# EAGLE design carret (EAGLE 5.11)
A: a
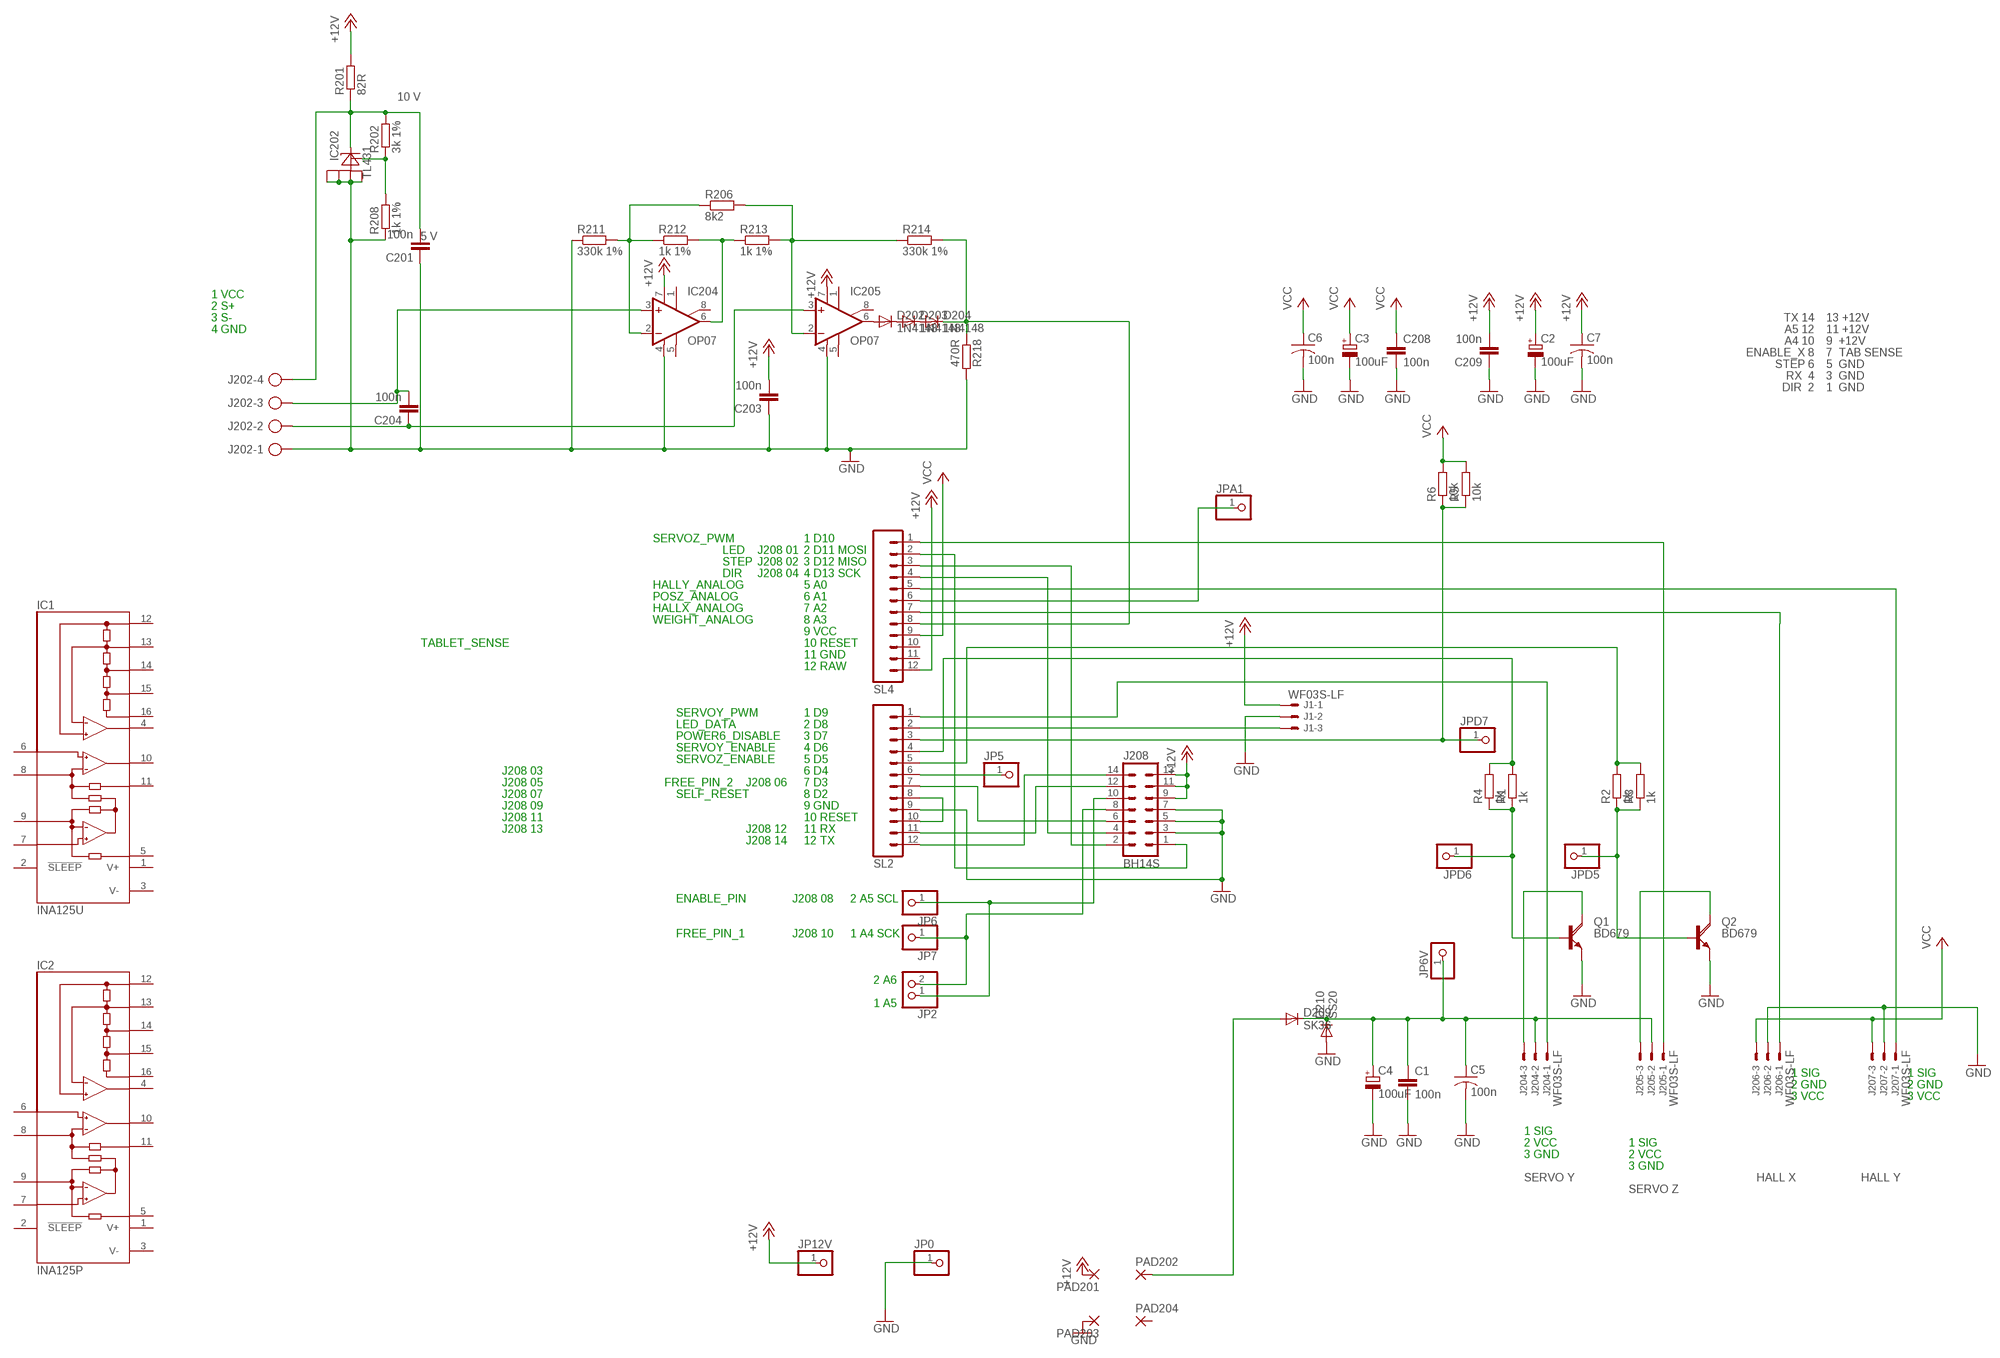
[diagram p0: schematic, sheet 1]

## Parts
C1  100n  CAP  [0805]
C2  100uF  CPOL-EUE3.5-8  [E3,5-8]
C3  100uF  CPOL-EUE3.5-8  [E3,5-8]
C4  100uF  CPOL-EUE3.5-8  [E3,5-8]
C5  100n  C-US050-030X075  [C050-030X075]
C6  100n  C-US050-030X075  [C050-030X075]
C7  100n  C-US050-030X075  [C050-030X075]
C201  100n  CAP  [0805]
C203  100n  CAP  [0805]
C204  100n  CAP  [0805]
C208  100n  CAP  [0805]
C209  100n  CAP  [0805]
D202  1N4148  DIODE-SOD80C  [SOD80C]
D203  1N4148  DIODE-SOD80C  [SOD80C]
D204  1N4148  DIODE-SOD80C  [SOD80C]
D209  SK36  DIODE-SMC  [SMC]
D210  SS20  DIODE-DO214AA  [DO214AA]
IC1  INA125U  [SO16-1]
IC2  INA125P  [DIL16]
IC202  TL431  [SO08]
IC204  OP07  OP07CR  [SO08]
IC205  OP07  OP07CR  [SO08]
J1  WF03S-LF  22-27-2031-03  [6410-03]
J202  AK300/4  [AK300/4]
J204  WF03S-LF  22-27-2031-03  [6410-03]
J205  WF03S-LF  22-27-2031-03  [6410-03]
J206  WF03S-LF  22-27-2031-03  [6410-03]
J207  WF03S-LF  22-27-2031-03  [6410-03]
J208  BH14S  ML14  [ML14]
JP0  PINHD-1X1  [1X01]
JP2  PINHD-1X2  [1X02]
JP5  PINHD-1X1  [1X01]
JP6  PINHD-1X1  [1X01]
JP6V  PINHD-1X1  [1X01]
JP7  PINHD-1X1  [1X01]
JP12V  PINHD-1X1  [1X01]
JPA1  PINHD-1X1  [1X01]
JPD5  PINHD-1X1  [1X01]
JPD6  PINHD-1X1  [1X01]
JPD7  PINHD-1X1  [1X01]
PAD201  3,81/1,1  [3,81/1,1]
PAD202  3,81/1,1  [3,81/1,1]
PAD203  3,81/1,1  [3,81/1,1]
PAD204  3,81/1,1  [3,81/1,1]
Q1  BD679  [TO126AV]
Q2  BD679  [TO126AV]
R1  1k  RES0805  [0805]
R2  1k  RES0805  [0805]
R3  1k  R-EU_0207/10  [0207/10]
R4  1k  R-EU_0207/10  [0207/10]
R5  10k  RES0805  [0805]
R6  10k  R-EU_0207/10  [0207/10]
R201  82R  RES0805  [0805]
R202  3k 1%  RES0805  [0805]
R206  8k2  RES0805  [0805]
R208  1k 1%  RES0805  [0805]
R211  330k 1%  RES0805  [0805]
R212  1k 1%  RES0805  [0805]
R213  1k 1%  RES0805  [0805]
R214  330k 1%  RES0805  [0805]
R218  470R  RES0805  [0805]
SL2  M12  [12P]
SL4  M12  [12P]

## Nets
+10V: C201.2 IC202.1(K) J202.4 R201.1 R202.2
+12V [power12]: C2.+ C7.1 C203.2 C209.2 IC204.7(V+) IC205.7(V+) J1.1 J208.9 J208.11 J208.13 JP12V.1 PAD201.1(P) R201.2 SL4.12
GND [ground]: C1.2 C2.- C3.- C4.- C5.2 C6.2 C7.2 C201.1 C203.1 C208.2 C209.1 D210.A IC202.2(A) IC202.3(A1) IC202.6(A2) IC202.7(A3) IC204.4(V-) IC205.4(V-) J1.2 J202.1 J206.2 J207.2 J208.3 J208.5 J208.7 JP0.1 PAD203.1(P) Q1.E Q2.E R208.1 R211.1 R218.2 SL2.9
N$1: JPD6.1 Q1.B R1.1 R4.1
N$2: J208.14 SL2.12
N$3: J1.3 SL2.2
N$4: JPD7.1 R5.1 R6.1 SL2.3
N$5: J206.1 SL4.7
N$6: J208.1 SL4.2
N$7: J208.12 SL2.11
N$8: J208.2 SL4.3
N$9: J208.10 JP2.1 JP6.1
N$10: J205.1 SL4.1
N$11: J208.8 JP2.2 JP7.1
N$12: J208.4 SL4.4
N$13: IC205.2(-IN) R206.2 R213.2 R214.1
N$14 [power12]: D209.A PAD202.1(P)
N$15: SL2.8 SL2.10
N$16: J207.1 SL4.5
N$17: J204.3 Q1.C
N$18: R1.2 R4.2 SL2.4
N$19: R2.2 R3.2 SL2.5
N$20: J205.3 Q2.C
N$21: J204.1 SL2.1
N$22 [power6]: C1.1 C4.+ C5.1 D209.C D210.C J204.2 J205.2 JP6V.1
N$23: JPD5.1 Q2.B R2.1 R3.1
N$24: JP5.1 SL2.6
N$27: J208.6 SL2.7
N$28: JPA1.1 SL4.6
N$41: D204.C R214.2 R218.1 SL4.8
N$43: IC202.8(REF) R202.1 R208.2
N$49: C204.2 IC204.3(+IN) J202.3
N$50: C204.1 IC205.3(+IN) J202.2
N$51: IC204.2(-IN) R206.1 R211.2 R212.1
N$52: IC204.6(OUT) R212.2 R213.1
N$54: D202.A IC205.6(OUT)
N$55: D202.C D203.A
N$56: D203.C D204.A
VCC [power5]: C3.+ C6.1 C208.1 J206.3 J207.3 R5.2 R6.2 SL4.9
Unconnected: IC1.2(!SLEEP) IC1.4(REFOUT) IC1.5(REF) IC1.6(+IN) IC1.7(-IN) IC1.8(RG) IC1.9(RG) IC1.10(OUT) IC1.11(SENSE) IC1.12(REFCOM) IC1.13(REFBG) IC1.14(REF2.5) IC1.15(REF5) IC1.16(REF10) IC2.2(!SLEEP) IC2.4(REFOUT) IC2.5(REF) IC2.6(+IN) IC2.7(-IN) IC2.8(RG) IC2.9(RG) IC2.10(OUT) IC2.11(SENSE) IC2.12(REFCOM) IC2.13(REFBG) IC2.14(REF2.5) IC2.15(REF5) IC2.16(REF10) IC204.1(ON1) IC204.5(OPT) IC204.8(ON2) IC205.1(ON1) IC205.5(OPT) IC205.8(ON2) PAD204.1(P) SL4.10 SL4.11

## Notes on the sheet
- 10 V
- 5 V
- 1 VCC
- 2 S+
- 3 S- | TX 14 | 13 +12V
- 4 GND | A5 12 | 11 +12V
- A4 10 | 9  +12V
- ENABLE_X 8 | 7  TAB SENSE
- STEP 6 | 5  GND
- RX  4 | 3  GND
- DIR  2 | 1  GND
- SERVOZ_PWM | 1 D10
- LED | J208 01 | 2 D11 MOSI
- STEP | J208 02 | 3 D12 MISO
- DIR | J208 04 | 4 D13 SCK
- HALLY_ANALOG | 5 A0
- POSZ_ANALOG | 6 A1
- HALLX_ANALOG | 7 A2
- WEIGHT_ANALOG | 8 A3
- 9 VCC
- TABLET_SENSE | 10 RESET
- 11 GND
- 12 RAW
- SERVOY_PWM | 1 D9
- LED_DATA | 2 D8
- POWER6_DISABLE | 3 D7
- SERVOY_ENABLE | 4 D6
- SERVOZ_ENABLE | 5 D5
- J208 03 | 6 D4
- J208 05 | FREE_PIN_2 | J208 06 | 7 D3
- J208 07 | SELF_RESET | 8 D2
- J208 09 | 9 GND
- J208 11 | 10 RESET
- J208 13 | J208 12 | 11 RX
- J208 14 | 12 TX
- ENABLE_PIN | J208 08 | 2 A5 SCL
- FREE_PIN_1 | J208 10 | 1 A4 SCK
- 2 A6
- 1 A5
- 1 SIG | 1 SIG
- 2 GND | 2 GND
- 3 VCC | 3 VCC
- 1 SIG
- 2 VCC | 1 SIG
- 3 GND | 2 VCC
- 3 GND
- SERVO Y | HALL X | HALL Y
- SERVO Z

## Power pins joined to a net without a drawn wire
V+: IC1.1(V+) IC2.1(V+)
V-: IC1.3(V-) IC2.3(V-)

## Library data of the parts
C1 C201 C203 C204 C208 C209 = barobot:CAP
C2-C4 = rcl:CPOL-EU: POLARIZED CAPACITOR, European symbol
C5-C7 = resistor:C-US: CAPACITOR, American symbol
D202-D204 D209 D210 = diode:DIODE-: DIODE
IC1 = burr-brown:INA125: Instrumentation Amplifier with Precision Voltage Reference; MF: TEXAS INSTRUMENT CONNECTORS; MPN: INA125U; OC_FARNELL: 1304375; OC_NEWARK: 80K5901
IC2 = burr-brown:INA125: Instrumentation Amplifier with Precision Voltage Reference; MF: TEXAS INSTRUMENT CONNECTORS; MPN: INA125P; OC_FARNELL: 1459461; OC_NEWARK: 35C1726
IC202 = 0alib:TL431
IC204 IC205 = linear:OP07*: OP AMP
J1 J204-J207 = con-molex:22-?-03: CONNECTOR wire to board 2.54 mm (.1 inch) pitch header; OC_FARNELL: unknown; OC_NEWARK: unknown
J202 = con-ptr500:AK300/4: CONNECTOR
J208 = con-ml:ML14: HARTING
JP0 JP5 JP6 JP6V JP7 JP12V JPA1 JPD5-JPD7 = pinhead:PINHD-1X1: PIN HEADER
JP2 = pinhead:PINHD-1X2: PIN HEADER
PAD201-PAD204 = wirepad:3,81/1,1: THROUGH-HOLE PAD
Q1 Q2 = transistor-power:BD679: NPN DARLINGTON TRANSISTOR
R1 R2 R5 R201 R202 R206 R208 R211-R214 R218 = barobot:RES
R3 R4 R6 = rcl:R-EU_: RESISTOR, European symbol
SL2 SL4 = con-amp-quick:M12: AMP QUICK CONNECTOR; OC_FARNELL: unknown; OC_NEWARK: unknown

## Net classes
0 default: width 0.381 mm, drill 0.254 mm, clearance 0.254 mm
1 power12: width 1.27 mm
2 ground: width 0.508 mm
3 power5: width 0.508 mm
4 power6: width 0.813 mm

## Board
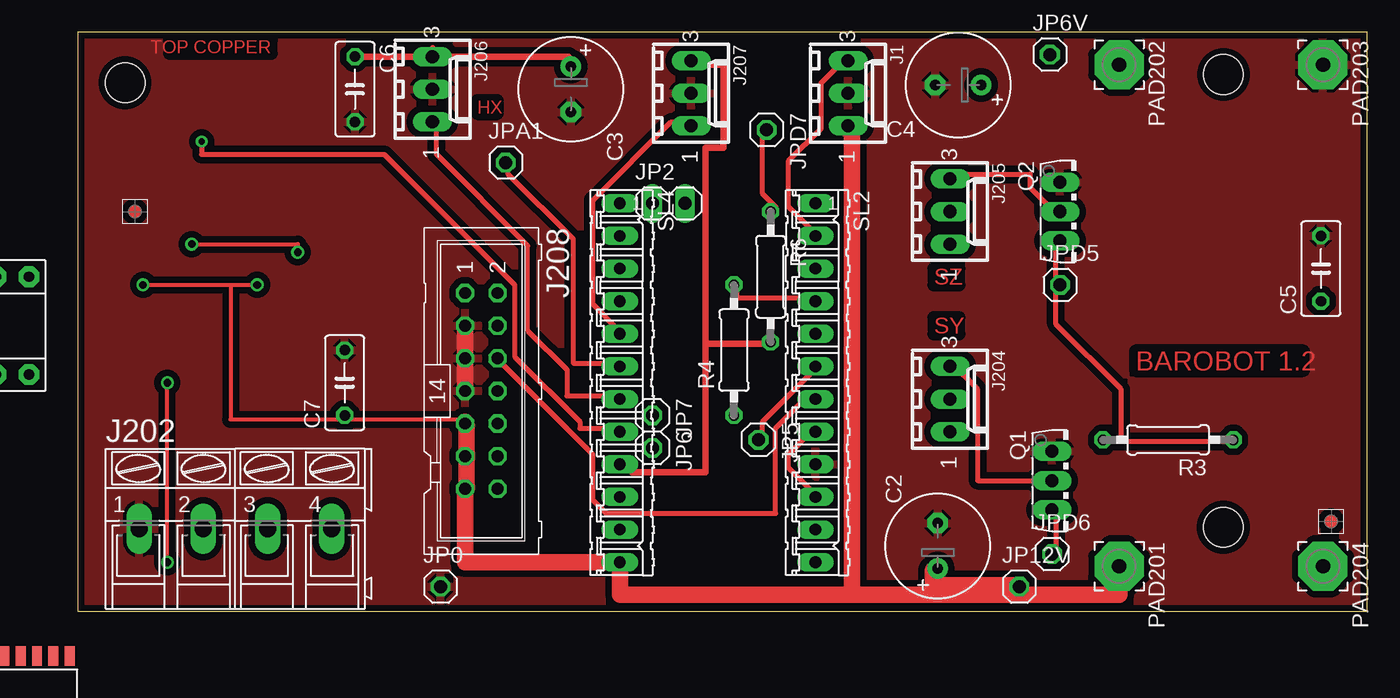
[diagram p1: board, top side]
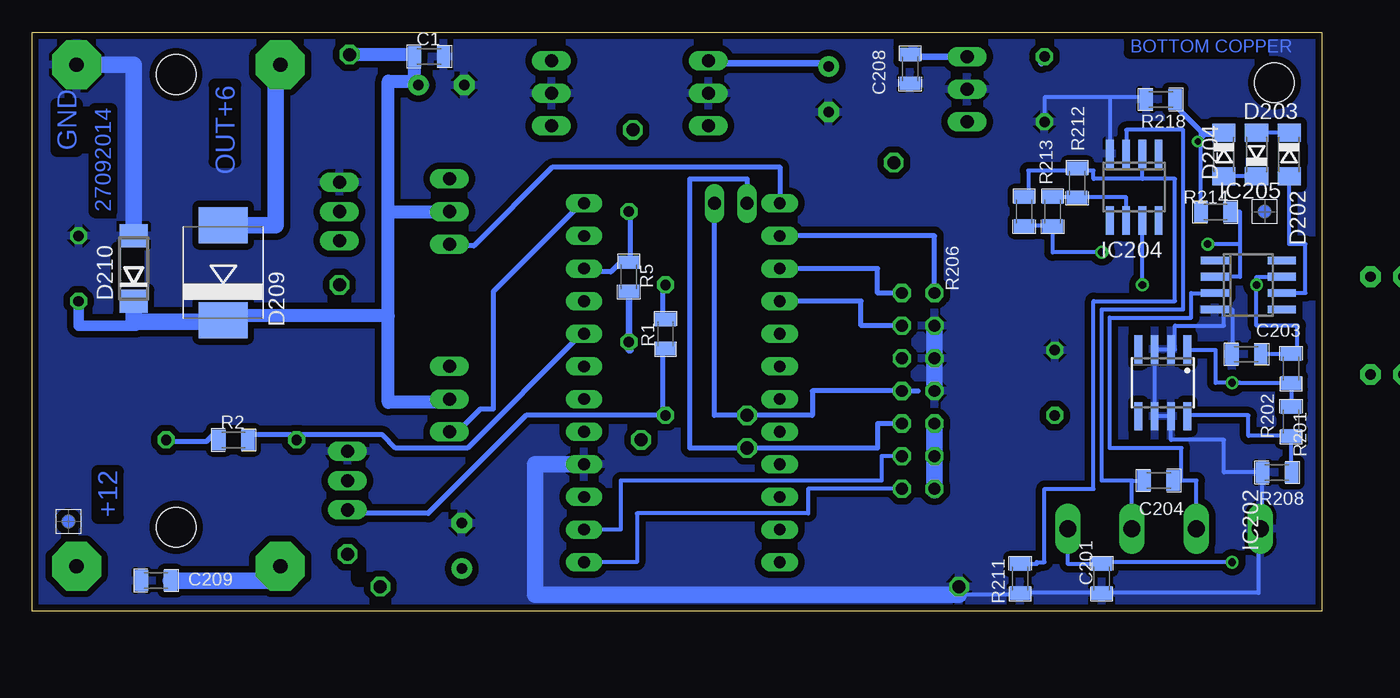
[diagram p2: board, bottom side, seen from below]

Size 100.46 x 45.09 mm. Coordinates in mm from the lower left corner, seen from the top.
Outline: 0,0 100.46,0 100.46,45.09 0,45.09 0,0
Copper layers (1*16): Top 0.035mm / dielectric 1.5mm / Bottom 0.035mm
Design rules "default *": minimum track width 10mil, minimum drill 0.5mm, track to track 10mil, track to pad 10mil, pad to pad 8mil, via to via 10mil, smd to smd 8mil, copper to edge 20mil, drill to drill 8mil, minimum pad ring 10mil, minimum via ring 8mil, stop-mask expansion 0mil, vias tented up to drill 0mil, thermal gap 10mil
Holes 3.1 mm at 89.23,6.54 89.25,41.78 3.68,41.15
bRestrict: area 92.2,25.4 to 93.8,28.3; area 1.6,34.9 to 8.6,36.2; area 74.9,2.4 to 75.1,4.6

### Footprints (pad centres in the part's own frame; a part is rotated, then mirrored left to right if it is on the bottom)
0805 = smd 1.044 x 1.6: 1 -1.127,0; 2 1.127,0
E3,5-8 = drill 0.813 pad 1.6 round: + -1.778,0 | drill 0.813 pad 1.6 octagon: - 1.778,0
C050-030X075 = drill 0.813 octagon: 1 -2.54,0; 2 2.54,0
SOD80C = smd 1.4 x 1.8: A 1.7,0; C -1.7,0
SMC = smd 2.8 x 3.8: A 3.7,0; C -3.7,0
DO214AA = smd 1.8 x 2.2: A 2.55,0; C -2.55,0
SO16-1 = smd 0.762 x 1.524: 1 -4.445,-4.775; 2 -3.175,-4.775; 3 -1.905,-4.775; 4 -0.635,-4.775; 5 0.635,-4.775; 6 1.905,-4.775; 7 3.175,-4.775; 8 4.445,-4.775; 9 4.445,4.775; 10 3.175,4.775; 11 1.905,4.775; 12 0.635,4.775; 13 -0.635,4.775; 14 -1.905,4.775; 15 -3.175,4.775; 16 -4.445,4.775
DIL16 = drill 0.813 pad 1.6 octagon: 1 -8.89,-3.81; 2 -6.35,-3.81; 3 -3.81,-3.81; 4 -1.27,-3.81; 5 1.27,-3.81; 6 3.81,-3.81; 7 6.35,-3.81; 8 8.89,-3.81; 9 8.89,3.81; 10 6.35,3.81; 11 3.81,3.81; 12 1.27,3.81; 13 -1.27,3.81; 14 -3.81,3.81; 15 -6.35,3.81; 16 -8.89,3.81
SO08 = smd 0.6 x 2.2: 1 -1.905,-2.6; 2 -0.635,-2.6; 3 0.635,-2.6; 4 1.905,-2.6; 5 1.905,2.6; 6 0.635,2.6; 7 -0.635,2.6; 8 -1.905,2.6
6410-03 = drill 1.016 long: 1 2.54,0; 2 0,0; 3 -2.54,0
AK300/4 = drill 1.321 long: 1 -7.493,0; 2 -2.515,0; 3 2.515,0; 4 7.493,0
ML14 = drill 0.914 octagon: 1 -7.62,-1.27; 2 -7.62,1.27; 3 -5.08,-1.27; 4 -5.08,1.27; 5 -2.54,-1.27; 6 -2.54,1.27; 7 0,-1.27; 8 0,1.27; 9 2.54,-1.27; 10 2.54,1.27; 11 5.08,-1.27; 12 5.08,1.27; 13 7.62,-1.27; 14 7.62,1.27
1X01 = drill 1.016 octagon: 1 0,0
1X02 = drill 1.016 long: 1 -1.27,0; 2 1.27,0
3,81/1,1 = drill 1.118 pad 3.81 octagon: 1 0,0
TO126AV = drill 1.016 long: B 2.286,-1.27; C 0,-1.27; E -2.286,-1.27
0207/10 = drill 0.813 octagon: 1 -5.08,0; 2 5.08,0
12P = drill 0.914 long: 1 -13.97,0; 2 -11.43,0; 3 -8.89,0; 4 -6.35,0; 5 -3.81,0; 6 -1.27,0; 7 1.27,0; 8 3.81,0; 9 6.35,0; 10 8.89,0; 11 11.43,0; 12 13.97,0

### Placement (x,y rotation side)
C1  69.53,43.18 0 bottom
C2  66.99,5.08 90 top
C3  38.42,40.64 270 top
C4  68.58,40.96 180 top
C5  96.84,26.67 90 top
C6  21.59,40.64 270 top
C7  20.8,17.78 90 top
C201  17.14,2.54 90 bottom
C203  5.87,20 0 bottom
C204  12.7,10.16 180 bottom
C208  32.07,42.23 270 bottom
C209  90.8,2.38 0 bottom
D202  2.54,35.56 270 bottom
D203  5.08,35.56 90 bottom
D204  7.62,35.56 270 bottom
D209  85.57,26.35 90 bottom
D210  92.55,26.67 90 bottom
IC1  -5.08,-8.26 0 top  (outside the outline)
IC2  -12.7,22.23 0 top  (outside the outline)
IC202  12.38,17.78 180 bottom
IC204  14.61,33.02 180 bottom
IC205  5.71,25.4 270 bottom
J1  60.01,40.32 270 top
J202  12.27,6.42 0 top
J204  67.94,16.51 270 top
J205  67.94,31.11 270 top
J206  27.62,40.64 270 top
J207  47.78,40.32 270 top
J208  31.43,17.14 270 top
JP0  28.26,1.91 0 top
JP2  46.04,31.75 0 top
JP5  53.02,13.34 270 top
JP6  44.77,12.7 270 top
JP6V  75.72,43.34 0 top
JP7  44.77,15.24 270 top
JP12V  73.34,1.91 0 top
JPA1  33.34,34.92 0 top
JPD5  76.52,25.4 0 top
JPD6  75.88,4.45 0 top
JPD7  53.66,37.47 270 top
PAD201  81.12,3.49 270 top
PAD202  81.12,42.55 270 top
PAD203  97,42.55 270 top
PAD204  97,3.49 270 top
Q1  77.15,10.16 270 top
Q2  77.79,31.11 270 top
R1  51.12,21.59 90 bottom
R2  84.77,13.34 0 bottom
R3  84.93,13.34 180 top
R4  51.12,20.32 90 top
R5  53.98,26.04 270 bottom
R6  53.98,26.04 270 top
R201  2.38,18.89 90 bottom
R202  2.38,14.76 90 bottom
R206  23.18,31.11 270 bottom
R208  3.49,10.79 0 bottom
R211  23.5,2.54 90 bottom
R212  19.05,33.34 270 bottom
R213  20.95,31.11 270 bottom
R214  8.28,31.08 180 bottom
R218  12.54,39.85 180 bottom
SL2  57.47,17.78 270 top
SL4  42.23,17.78 270 top
U$1  [FIDUCIAL_G10S]  4.45,31.11 0 top
U$2  [FIDUCIAL_G10S]  97.63,6.99 0 top
U$3  [FIDUCIAL_G10S]  97.63,6.99 0 bottom
U$4  [FIDUCIAL_G10S]  4.45,31.11 0 bottom

### Tracks (layer width: path | path; a pad name or v marks a point on that pad's centre or on a via)
+10V  (via drill 0.6 pad 0.6)
  Top 0.305: v6.99,3.81 v6.99,17.78
  Bottom 0.305: C201.2 19.76,3.67 J202.4 | R202.2 | R202.2 R201.1 6.35,17.76 | 6.35,17.76 8.26,17.76 8.26,20.32 10.48,20.32 IC202.1 | v6.99,17.78 6.35,17.78 6.35,17.76 | v6.99,3.81 17.14,3.81
  Bottom 0.508: 17.14,3.81 C201.2
+12V  (via drill 0.6 pad 0.6)
  Top 0.305: J208.9 30.16,14.92 20.83,14.92 11.91,14.92 11.91,25.4 | v5.08,25.4 11.91,25.4 | 11.91,25.4 v13.97,25.4
  Top 0.508: C7.1 20.83,15.24 20.83,14.92
  Top 1.27: J208.13 30.29,9.53 30.29,11.94 30.16,11.94 J208.11 30.29,12.06 30.29,14.48 30.16,14.48 J208.9 30.16,14.73 | J208.13 30.16,3.81 SL4.12 42.23,1.27 60.33,1.27 | 60.33,1.27 66.61,1.27 | PAD201.1 81.12,1.27 66.61,1.27 | J208.13 30.16,9.65 | C2.+ 66.99,3.17 66.61,3.17 66.61,2.03 | 66.61,1.27 66.61,2.03 | JP12V.1 73.34,2.03 66.61,2.03 | 60.33,1.27 60.33,37.47 60.01,37.47 J1.1
  Bottom 0.305: C203.2 4.75,20.02 R201.2 1.91,20.02 1.91,22.23 5.08,22.23 v5.08,25.4 5.08,26.04 IC205.7 | v13.97,25.4 IC204.7
  Bottom 1.27: 30.16,9.4 J208.13 J208.9 | SL4.12 41.85,3.81 | C209.2 89.63,2.38 89.63,2.35 81.12,2.35 PAD201.1 80.99,3.49 80.99,3.11
GND
  Top 1.27: J208.7 J208.3
  Bottom 0.305: C203.1 6.99,20 6.99,23.5 7.62,23.5 | 28.26,1.27 24.13,1.27 24.13,1.41 R211.1 C201.1 17.14,1.43 4.92,1.43 4.92,6.42 J202.1 4.62,6.42 R208.1 7.62,10.79 7.62,13.34 11.75,13.34 IC202.7 IC202.6 IC202.3 IC202.2 11.43,20.38 11.43,22.23 7.62,22.23 7.62,23.5 | 28.26,1.27 28.57,1.27 | 28.26,1.27 | 7.62,23.5 IC205.4 | 16.51,40.01 IC204.4 | 16.51,40.01 13.67,40.01 R218.2 | 16.51,40.01 21.59,40.01 C6.2
  Bottom 1.016: C4.- 66.99,40.96
  Bottom 1.27: 28.26,1.27 61.28,1.27 61.28,11.43 SL2.9 | J208.7 J208.5 J208.3 | PAD203.1 92.55,42.55 D210.A
  pour Top (isolate 0.508, rank 3): 0,45.09 100.33,45.09 100.33,0 0,0
  pour Bottom (isolate 0.508): 0,45.09 100.33,45.09 100.46,0 0,0
N$1
  Top 0.381: JPD6.1 75.69,4.57 76.2,5.08 76.2,7.62 Q1.B
  Bottom 0.381: 51.31,15.24 51.31,20.32 R1.1 | 51.31,15.24 61.98,15.24 69.6,7.62 75.69,7.62 Q1.B | R4.1 51.31,15.24
N$2
  Bottom 0.305: J208.14 40.01,9.53 40.01,7.62 53.34,7.62 53.34,3.81 SL2.12
N$3
  Top 0.381: SL2.2 57.4,29.46 55.37,31.5 55.37,35.05 57.91,37.59 57.91,41.15 59.94,43.18 J1.3
N$4
  Top 0.381: R6.1 54.36,31.5 53.34,32.51 53.34,37.08 JPD7.1
  Bottom 0.381: SL2.3 57.4,26.42 55.37,26.42 54.36,27.43 R5.1 53.85,27.43 53.85,30.99 R6.1
N$5
  Top 0.381: SL4.7 42.16,16.76 38.1,16.76 38.1,18.8 35.05,21.84 35.05,28.45 27.94,35.56 27.94,38.1 J206.1
N$6
  Bottom 0.406: SL4.2 30.16,29.21 J208.1
N$7
  Bottom 0.305: J208.12 34.29,12.06 34.29,10.16 54.61,10.16 54.61,6.35 SL2.11
N$8
  Bottom 0.406: J208.2 34.61,24.77 34.61,26.67 SL4.3
N$9
  Bottom 0.406: J208.10 34.61,14.61 34.61,12.7 JP6.1 49.21,12.7 49.21,33.66 44.77,33.66 JP2.1
N$10
  Bottom 0.381: SL4.1 42.16,32 42.16,34.54 59.94,34.54 66.04,28.45 67.56,28.45 J205.1
N$11
  Bottom 0.406: 47.31,22.86 JP2.2 | 31.43,17.14 J208.8 39.69,17.14 39.69,15.24 JP7.1 47.31,15.24 47.31,22.86 | 47.31,22.86
N$12
  Bottom 0.406: J208.4 35.88,22.23 35.88,24.13 SL4.4
N$13  (via drill 0.6 pad 0.6)
  Top 0.305: v8.89,28.57 17.14,28.57 v17.14,27.94
  Bottom 0.305: R206.2 R213.2 20.95,27.94 v17.14,27.94 | IC205.2 6.35,26.04 6.35,28.57 | 6.35,28.57 v8.89,28.57 | R214.1 6.35,31.08 6.35,28.57
N$14
  Bottom 1.27: D209.A 85.57,30.04 81.5,30.04 81.5,42.55 PAD202.1
N$15
  Top 0.381: SL2.10 57.4,9.14 55.37,11.18 55.37,12.19 57.4,14.22 SL2.8
N$16
  Top 0.381: SL4.5 42.16,21.84 40.13,23.88 40.13,32 46.23,38.1 47.75,38.1 J207.1
N$17
  Top 0.381: Q1.C 70.1,10.16 70.1,17.27 68.07,19.3 J204.3
N$18
  Top 0.381: SL2.4 57.4,24.38 51.31,24.38 51.31,25.4 R4.2
  Bottom 0.381: R1.2 51.31,22.86 51.31,25.4 R4.2
N$19
  Bottom 0.381: R2.2 83.31,13.72 80.26,13.72 R3.2 79.76,13.72 73.15,13.72 72.14,12.7 66.55,12.7 57.91,21.34 SL2.5
N$20
  Top 0.381: J205.3 68.07,34.04 74.17,34.04 74.17,33.02 76.2,30.99 Q2.C
N$21
  Bottom 0.381: SL2.1 57.91,31.5 64.52,24.89 64.52,15.75 65.53,15.75 67.06,14.22 67.56,14.22 J204.1
N$22
  Bottom 0.813: 87.06,21.97 85.57,21.97 85.57,22.54 | D209.C 85.03,22.65 85.03,22.99 | 96.71,24 96.84,24 C5.1 96.84,22.23 92.39,22.23 92.39,22.54 | J204.2 67.94,16.26 | 70.36,41.27 C4.+
  Bottom 1.016: 72.71,22.99 85.03,22.99 | 72.71,22.99 72.71,16.26 67.94,16.26 | 70.36,41.27 72.71,41.27 72.71,31.11 | 72.71,31.11 J205.2 | 72.71,22.99 72.71,31.11 | 70.02,40.96 C4.+ 70.66,40.96 C1.1 70.66,43.34 JP6V.1
  Bottom 1.27: D210.C 92.55,22.54 92.39,22.54 85.57,22.54 D209.C
N$23
  Top 0.381: Q2.B 76.2,28.45 76.2,25.91 76.71,25.4 JPD5.1 76.2,25.4 76.2,22.35 81.28,17.27 81.28,13.21 89.92,13.21 R3.1
  Bottom 0.381: R2.1 86.36,13.72 86.87,13.21 89.92,13.21 R3.1
N$24
  Top 0.381: SL2.6 57.4,18.8 53.34,14.73 53.34,13.72 JP5.1
N$27
  Top 0.381: J208.6 33.02,19.3 40.13,12.19 40.13,8.64 41.15,7.62 54.36,7.62 54.36,14.22 56.9,16.76 57.4,16.76 SL2.7
N$28
  Top 0.381: SL4.6 42.16,19.3 38.61,19.3 38.61,28.96 33.53,34.04 33.53,34.54 JPA1.1
N$41  (via drill 0.5)
  Top 0.381: v9.65,36.58 9.65,35.56 23.88,35.56 34.04,25.4 34.04,19.81 39.12,14.73 39.12,14.22 42.16,14.22 SL4.8
  Bottom 0.305: D204.C 9.41,37.26 R214.2
  Bottom 0.381: 9.14,37.08 11.68,39.62 R218.1 | 9.14,37.08 7.62,37.08 D204.C | 9.14,37.08 v9.65,36.58
N$43
  Bottom 0.305: R208.2 2.38,10.79 R202.1 5.71,13.64 5.71,15.24 10.48,15.24 IC202.8
N$49
  Bottom 0.305: 14.79,10.16 C204.2 | J202.3 14.79,10.16 | 14.79,10.16 17.14,10.16 17.14,23.5 10.79,23.5 10.79,37.47 15.24,37.47 IC204.3
N$50
  Bottom 0.305: J202.2 9.76,10.16 10.94,10.16 | 10.94,10.16 C204.1 | 10.94,10.16 10.94,12.7 16.51,12.7 16.51,22.86 10.16,22.86 10.16,24.77 IC205.3
N$51
  Bottom 0.305: R206.1 22.86,32.24 22.86,34.29 19.05,34.29 | 13.97,33.66 IC204.2 | R211.2 22.23,3.67 22.23,3.81 21.59,3.81 21.59,9.53 17.78,9.53 17.78,24.13 11.43,24.13 11.43,33.66 13.97,33.66 | 13.97,33.66 17.78,33.66 17.78,34.29 19.05,34.29 | 19.05,34.29 R212.1
N$52
  Bottom 0.305: R213.1 19.05,32.24 R212.2 15.24,32.21 IC204.6
N$54
  Bottom 0.305: IC205.6 1.27,24.77 1.27,28.57 2.54,28.57 D202.A
N$55
  Bottom 0.305: D202.C D203.A
N$56
  Bottom 0.305: D203.C D204.A
V+  (1 unrouted)
V-  (1 unrouted)
VCC
  Top 0.508: J206.3 27.62,43.81 | J206.3 C6.1 | 42.23,11.68 SL4.9 43.18,11.43 43.18,10.79 48.9,10.79 48.9,20.83 | 38.1,43.18 38.23,43.18 | 38.1,43.18 J206.3 | 48.9,20.83 48.9,36.07 50.29,36.07 50.29,42.55 48.26,42.55 48.26,42.67 47.78,42.67 J207.3 | 38.1,43.18 38.1,42.67 38.61,42.67 38.61,42.42 C3.+ | 48.9,20.83 53.98,20.83 R6.2
  Bottom 0.508: 21.84,42.67 21.84,43.18 C6.1 | 27.43,42.67 27.43,43.18 J206.3 31.62,43.18 31.62,43.69 32.07,43.69 C208.1 | C208.1 32.07,43.18 | C208.1 32.07,43.66 | J207.3 47.75,42.86 47.75,43.18 47.24,43.18 47.24,42.67 38.42,42.67 C3.+ | 53.85,20.32 53.98,20.32 53.98,20.83 | R6.2 53.98,20.83 | R6.2 R5.2 | R6.2 53.85,20.95 53.85,20.83 53.98,20.83

### Text on the board
Top: TOP COPPER | HX | HY | LED | SZ | SY | BAROBOT 1.2
Bottom: BOTTOM COPPER | OUT+6 | GND | 27092014 | +12